# Altium schematic sheet MCUReset.SchDoc
size A4; SheetNumber: 6; SheetTotal: 14
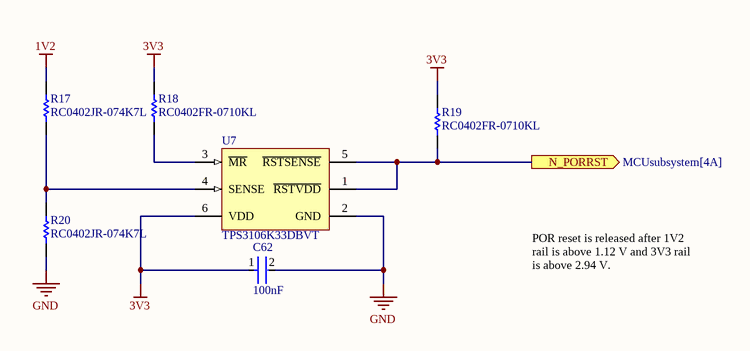
[diagram p0: MCUReset.SchDoc]

## Parts
C62  Capacitance: 100nF  [FP-GRM155-0_05-IPC_C]  (hidden comment: GRM155R71E104KE14J)
R17  RC0402JR-074K7L  [RESC1005X40X25LL05T10]
R18  RC0402FR-0710KL  [RESC1005X40X25LL05T10]
R19  RC0402FR-0710KL  [RESC1005X40X25LL05T10]
R20  RC0402JR-074K7L  [RESC1005X40X25LL05T10]
U7  TPS3106K33DBVT  [DBV0006A_N]

## Ports
N_PORRST (out, see MCUsubsystem[4A])

## Nets
1V2: R17.2
3V3: C62.1 R18.2 R19.2 U7.6(VDD)
GND: C62.2 R20.1 U7.2(GND)
N_PORRST: R19.1 U7.1(~{RSTVDD}) U7.5(~{RSTSENSE}) ; port N_PORRST
NetR17_1: R17.1 R20.2 U7.4(SENSE)
NetR18_1: R18.1 U7.3(~{MR})

## Notes on the sheet
- POR reset is released after 1V2 rail is above 1.12 V and 3V3 rail is above 2.94 V.

## Library data of the parts
C62 = CMP-06035-003995-1: Chip Multilayer Ceramic Capacitors for General Purpose, 0402, 0.10uF, X7R, 15%, 10%, 25V; Resistor Type: Ceramic; Tolerance: 10%; Case Code (Metric): 1005; Termination: SMD/SMT; Mount: Surface Mount; Voltage Rating: 25V; Voltage Rating (DC): 25V; Case Code (Imperial): 0402; Max Operating Temperature: 125°C; Weight: 0.000212oz; Case/Package: 0402; Length: 0.039inch; Width: 0.5mm; Thickness: 0.022inch; Height: 0.5mm; Packaging: Tape and Reel; Package Quantity: 50000; Min Operating Temperature: -55°C; Dielectric: X7R
R17 R20 = CMP-2002-08011-1: Manufacturer: Yageo / Phycomp; Part Number: RC0402JR-074K7L
R18 R19 = CMP-2002-07353-1: Manufacturer: Yageo / Phycomp; Part Number: RC0402FR-0710KL
U7 = CMP-0332-00579-2: Ultra Low-Supply Current / Supply-Voltage Supervisory Circuit, 2 Supply Monitored, -40 to 85 degC, 6-pin SOT-23 (DBV), Green (RoHS & no Sb/Br); Manufacturer: Texas Instruments; VCC(Max)(V): 3.3; Rating: Catalog; Threshold Voltage 2 (typ)(Typ)(V): Adjustable; Reset Threshold Accuracy(%): 0.75; SubFamily: Supervisor and Reset IC; # of Supplies Monitored: 2; Time Delay(ms): 130; Threshold Voltage 1 (typ)(Typ)(V): 2.941; Output Driver Type / Reset Output: Active-low, Open-drain; VCC(Min)(V): 0.4; Iq(Typ)(uA): 1.2; ComponentLink1Description: Datasheet; PackageReference: DBV0006A; Code_JEDEC: MO-178-AB*; PackageVersion: revK, Mar-2006; DatasheetVersion: SLVS363E; Mounting Technology: Surface Mount; PackageDescription: 6-Pin Plastic Small-Outline Package, 2.9 x 1.6 mm Body, 0.95 mm Pitch, 2.8 mm Lead Span; ComponentLink1URL: http://www.ti.com/general/docs/lit/getliterature.tsp?genericPartNumber=TPS3106K33&fileType=pdf; PartNumber: TPS3106K33DBVT